# EAGLE design 2 channel DIP (EAGLE 6.5.0)
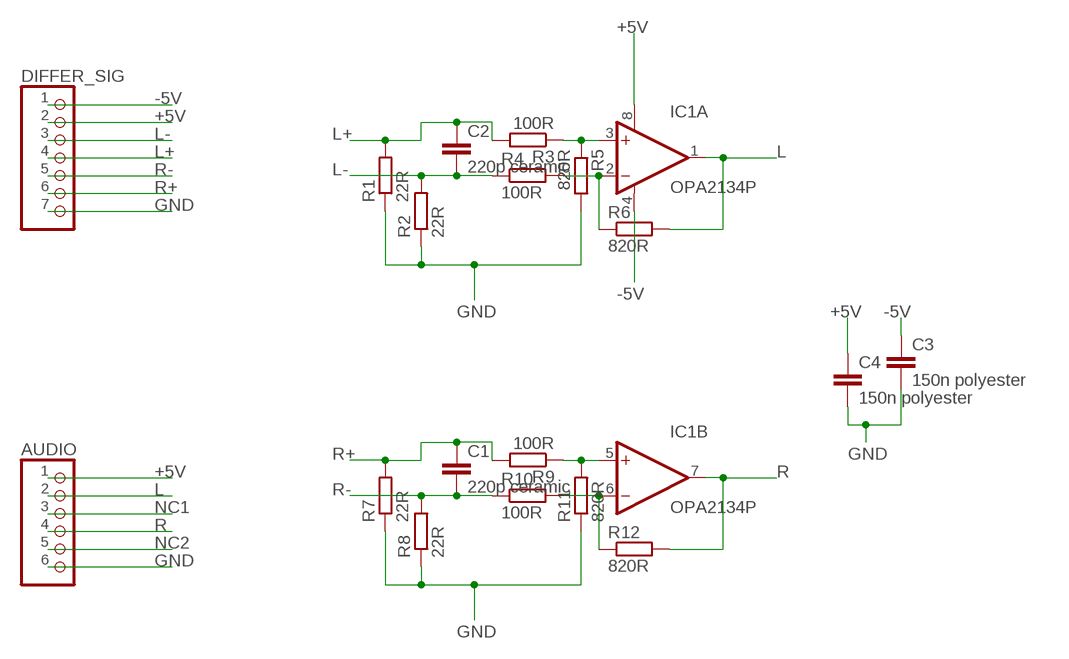
[diagram p0: schematic, sheet 1]

## Parts
AUDIO  PINHD-1X6  [1X06]
C1  220p ceramic  C-EU050-030X075  [C050-030X075]
C2  220p ceramic  C-EU050-030X075  [C050-030X075]
C3  150n polyester  C-EU050-030X075  [C050-030X075]
C4  150n polyester  C-EU050-030X075  [C050-030X075]
DIFFER_SIG  PINHD-1X7  [1X07]
IC1  OPA2134P  [DIL08]
R1  22R  R-EU_0207/7  [0207/7]
R2  22R  R-EU_0207/7  [0207/7]
R3  100R  R-EU_0207/7  [0207/7]
R4  100R  R-EU_0207/7  [0207/7]
R5  820R  R-EU_0207/7  [0207/7]
R6  820R  R-EU_0207/7  [0207/7]
R7  22R  R-EU_0207/7  [0207/7]
R8  22R  R-EU_0207/7  [0207/7]
R9  100R  R-EU_0207/7  [0207/7]
R10  100R  R-EU_0207/7  [0207/7]
R11  820R  R-EU_0207/7  [0207/7]
R12  820R  R-EU_0207/7  [0207/7]

## Nets
+5V: AUDIO.1 C4.1 DIFFER_SIG.2 IC1.8(A:V+)
-5V: C3.1 DIFFER_SIG.1 IC1.4(A:V-)
GND: AUDIO.6 C3.2 C4.2 DIFFER_SIG.7 R1.1 R2.1 R5.2 R7.1 R8.1 R11.1
L: AUDIO.2 IC1.1(A:OUT) R6.2
L+: C2.1 DIFFER_SIG.4 R1.2 R3.2
L-: C2.2 DIFFER_SIG.3 R2.2 R4.1
N$4: IC1.3(A:+IN) R3.1 R5.1
N$5: IC1.2(A:-IN) R4.2 R6.1
N$8: IC1.5(B:+IN) R9.1 R11.2
N$9: IC1.6(B:-IN) R10.2 R12.1
NC1: AUDIO.3
NC2: AUDIO.5
R: AUDIO.4 IC1.7(B:OUT) R12.2
R+: C1.1 DIFFER_SIG.6 R7.2 R9.2
R-: C1.2 DIFFER_SIG.5 R8.2 R10.1

## Library data of the parts
AUDIO = pinhead:PINHD-1X6: PIN HEADER
C1-C4 = rcl:C-EU: CAPACITOR, European symbol
DIFFER_SIG = pinhead:PINHD-1X7: PIN HEADER
IC1 = burr-brown:OPA2134: Operational Amplifier; MF: TEXAS INSTRUMENTS; MPN: OPA2134PA; OC_FARNELL: 1097574; OC_NEWARK: 74K3897
R1-R12 = resistor:R-EU_: RESISTOR, European symbol

## Board
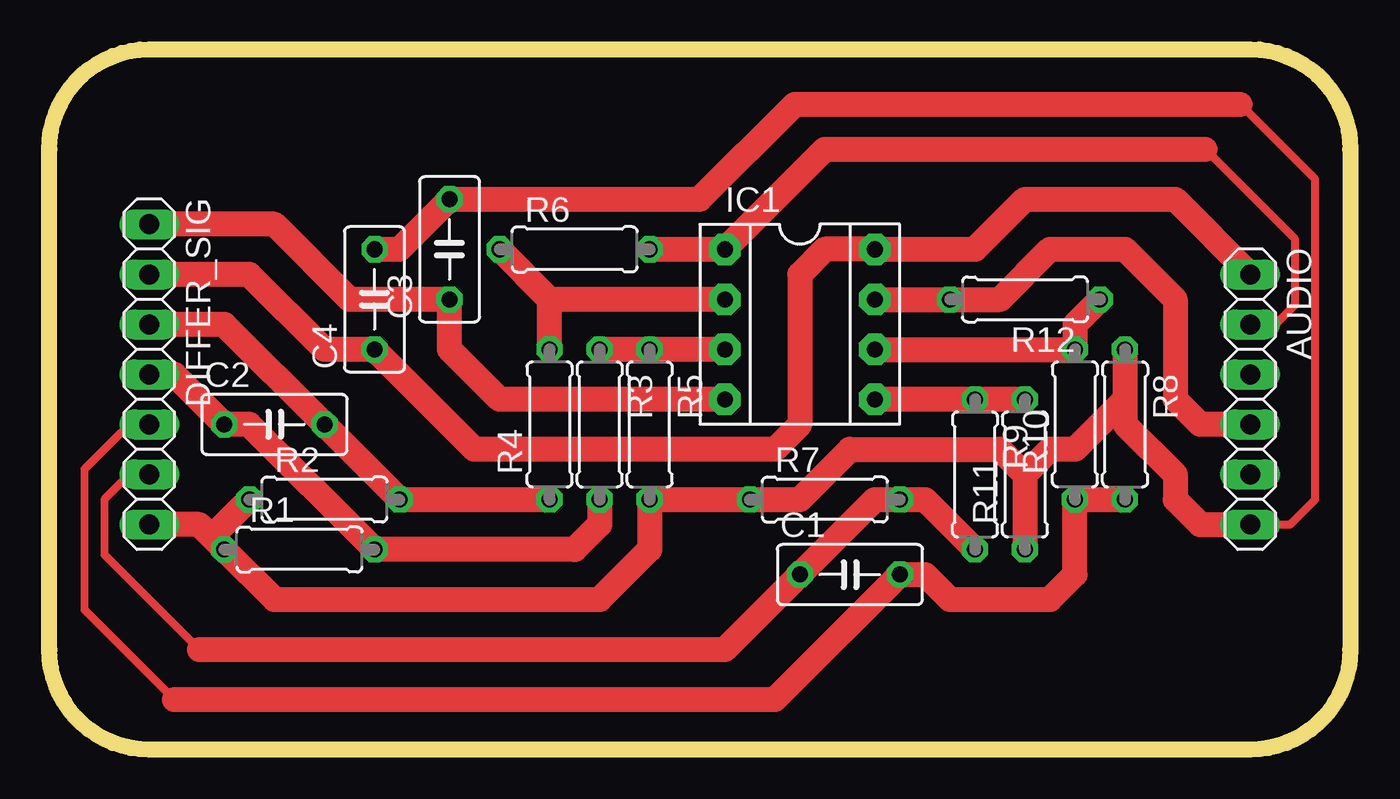
[diagram p1: board, top side]

Size 66.04 x 35.56 mm. Coordinates in mm from the lower left corner, seen from the top.
Outline: 0,5.08 0,30.48 arc-90 5.08,35.56 60.96,35.56 arc-90 66.04,30.48 66.04,5.08 arc-90 60.96,0 5.08,0 arc-90 0,5.08
Copper layers (1*16): Top 0.035mm / dielectric 1.5mm / Bottom 0.035mm
Design rules "default": minimum track width 10mil, minimum drill 24mil, track to track 8mil, track to pad 8mil, pad to pad 8mil, via to via 8mil, smd to smd 8mil, copper to edge 40mil, drill to drill 8mil, minimum pad ring 10mil, minimum via ring 8mil, stop-mask expansion 4mil, vias tented up to drill 0mil, thermal gap 10mil

### Footprints (pad centres in the part's own frame; a part is rotated, then mirrored left to right if it is on the bottom)
1X06 = drill 1.016 long: 1 -6.35,0; 2 -3.81,0; 3 -1.27,0; 4 1.27,0; 5 3.81,0; 6 6.35,0
C050-030X075 = drill 0.813 octagon: 1 -2.54,0; 2 2.54,0
1X07 = drill 1.016 long: 1 -7.62,0; 2 -5.08,0; 3 -2.54,0; 4 0,0; 5 2.54,0; 6 5.08,0; 7 7.62,0
DIL08 = drill 0.813 pad 1.6 octagon: 1 -3.81,-3.81; 2 -1.27,-3.81; 3 1.27,-3.81; 4 3.81,-3.81; 5 3.81,3.81; 6 1.27,3.81; 7 -1.27,3.81; 8 -3.81,3.81
0207/7 = drill 0.813 octagon: 1 -3.81,0; 2 3.81,0

### Placement (x,y rotation side)
AUDIO  60.96,17.78 270 top
C1  40.64,8.89 0 top
C2  11.43,16.51 0 top
C3  20.32,25.4 90 top
C4  16.51,22.86 90 top
DIFFER_SIG  5.08,19.05 270 top
IC1  38.1,21.59 270 top
R1  12.7,10.16 0 top
R2  13.97,12.7 0 top
R3  27.94,16.51 270 top
R4  25.4,16.51 90 top
R5  30.48,16.51 270 top
R6  26.67,25.4 0 top
R7  39.37,12.7 0 top
R8  54.61,16.51 270 top
R9  46.99,13.97 270 top
R10  52.07,16.51 90 top
R11  49.53,13.97 90 top
R12  49.53,22.86 180 top

### Tracks (layer width: path | path; a pad name or v marks a point on that pad's centre or on a via)
+5V
  Top 1.27: AUDIO.1 57.15,27.94 49.53,27.94 46.99,25.4 IC1.8 39.37,25.4 38.1,24.13 38.1,16.51 36.83,15.24 21.59,15.24 C4.1 13.97,20.32 10.16,24.13 DIFFER_SIG.2
-5V
  Top 1.27: IC1.4 22.86,17.78 20.32,20.32 C3.1 15.24,22.86 11.43,26.67 DIFFER_SIG.1
GND
  Top 0.406: 60.45,32.77 64.26,28.96 64.26,12.7 62.99,11.43 AUDIO.6
  Top 1.27: 49.53,13.97 50.8,15.24 52.07,15.24 54.61,17.78 R8.1 54.61,16.51 57.15,13.97 57.15,12.7 58.42,11.43 AUDIO.6 | 49.53,13.97 R11.1 | 49.53,13.97 48.26,15.24 40.64,15.24 38.1,12.7 R7.1 R5.2 30.48,10.16 27.94,7.62 11.43,7.62 R1.1 8.25,10.79 | C4.2 17.78,25.4 C3.2 33.02,27.94 37.85,32.77 60.45,32.77 | 8.25,10.79 7.62,11.43 DIFFER_SIG.7 | R2.1 8.25,10.79
L
  Top 0.406: 58.67,30.48 63.25,25.91 63.25,22.61 62.23,21.59 AUDIO.2
  Top 1.27: R6.2 IC1.1 39.37,30.48 58.67,30.48
L+
  Top 1.27: R3.2 27.94,11.43 26.67,10.16 R1.2 10.16,16.51 C2.1 6.35,19.05 DIFFER_SIG.4
L-
  Top 1.27: R4.1 R2.2 C2.2 8.89,21.59 DIFFER_SIG.3
N$4
  Top 1.27: IC1.3 R5.1 R3.1
N$5
  Top 1.27: R4.2 25.4,22.86 | 25.4,22.86 R6.1 | IC1.2 25.4,22.86
N$8
  Top 1.27: R11.2 R9.1 IC1.5
N$9
  Top 1.27: R12.1 52.07,21.59 R10.2 IC1.6
R
  Top 1.27: IC1.7 R12.2 48.26,22.86 50.8,25.4 54.61,25.4 57.15,22.86 57.15,17.78 58.42,16.51 AUDIO.4
R+
  Top 0.406: DIFFER_SIG.6 4.06,13.97 2.79,12.7 2.79,9.91 7.62,5.08
  Top 1.27: R9.2 44.45,12.7 R7.2 41.91,12.7 C1.1 34.29,5.08 7.62,5.08
R-
  Top 0.406: DIFFER_SIG.5 4.06,16.51 1.78,14.22 1.78,7.11 6.35,2.54
  Top 1.27: R8.2 R10.1 52.07,8.89 50.8,7.62 45.72,7.62 44.45,8.89 C1.2 36.83,2.54 6.35,2.54